# Altium schematic sheet SCH_07_ADC.SchDoc
size A4; SheetNumber: 12; SheetTotal: 12; SPICEModelCacheAFFBQUIG: <root> / <DocumentId>AFFBQUIG</DocumentId> / <CacheFrame Number="0"> / <Model Name="0603_885012106031_10uf" Kind="CKT"> / <Text>******* / .subckt 0603_885012106031_10uF 1 2 / Rser 1 3 0.0105 / Lser 2 4 0.0000000008 / C1 3 4 0.00001 / Rpar 3 4 10000000 / .ends 0603_885012106031_10uF</Text> / </Model> / <Model Name="0603_885012206095_100nf" Kind="CKT"> / <Text>******* / .subckt 0603_885012206095_100nF 1 2 / Rser 1 3 0.0157659152881 / Lser 2 4 3.10171966E-10 / C1 3 4 0.0000001 / Rpar 3 4 5000000000 / .ends 0603_885012206095_100nF</Text> / </Model> / </CacheFrame> / </root>
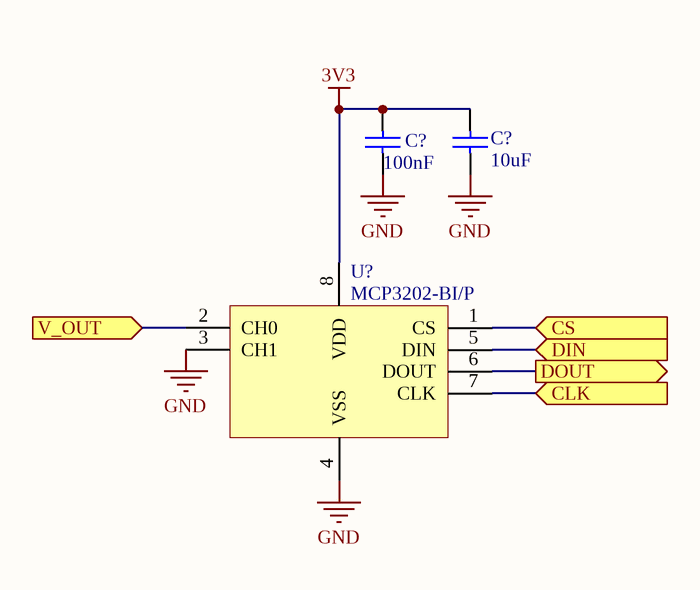
[diagram p0: SCH_07_ADC.SchDoc]

## Parts
(Parts that share a designator on the sheet are numbered #1, #2 ... from top to bottom, then left to right.)
C?#1  100nF  [WCAP-CSGP_0603_L1.6W0.8H0.8_Reflow]
C?#2  10uF  [WCAP-CSGP_0603_L1.6W0.8H0.8_Reflow]
U?  MCP3202-BI/P  [DIP787W46P254L927H533Q8]

## Ports
CLK (in, see Schematic_Top[4B]), CS (in, see Schematic_Top[4B]), DIN (in, see Schematic_Top[4B]), DOUT (out, see Schematic_Top[4B]), V_OUT (in, see Schematic_Top[3B], SCH_06_Filter[4C])

## Nets
3V3: C?#1.2 C?#2.2 U?.8(VDD)
GND: C?#1.1 C?#2.1 U?.3(CH1) U?.4(VSS)
CLK: U?.7(CLK) ; port CLK
CS: U?.1(CS) ; port CS
DIN: U?.5(DIN) ; port DIN
DOUT: U?.6(DOUT) ; port DOUT
V_OUT: U?.2(CH0) ; port V_OUT

## Notes on the sheet
- Title:
- Date:
- Time:
- Drawn by:
- Phung Nhat Minh
- Sheet
- of

## Library data of the parts
C?#1 = 885012206095: WCAP-CSGP Multilayer Ceramic Chip Capacitor, General Purpose, size 0603, X7R, 100nF, 50VDC; Manufacturer: Wurth Elektronik; Case/Size Code: 0603; Capacitance Tolerance: +/-10%; Dissipation Factor: 3%; Insulation Resistance: 5GOhm; Rated Voltage (DC): 50V; Technical Reference: X7R0603104K050DFCT10000; Manufacturer Part Number: 885012206095; Category: Multilayer Ceramic Chip Capacitors; Match Code: WCAP-CSGP; ComponentLink1Description: Website Link; ComponentLink1URL: https://www.we-online.com/redexpert/article/885012206095?ad; ComponentLink2Description: Datasheet Link; ComponentLink2URL: https://www.we-online.com/redexpert/spec/885012206095?ad; Mount: Surface Mount; Operating Temperature Max: 125°C; Operating Temperature Min: -55°C; Packaging: Tape and Reel; Length: 1.6mm; Width: 0.8mm; Height: 0.8mm; Capacitance: 100nF; Ceramic Type: X7R
C?#2 = 885012106031: WCAP-CSGP Multilayer Ceramic Chip Capacitor, General Purpose, size 0603, X5R, 10uF, 25VDC; Manufacturer: Wurth Elektronik; Case/Size Code: 0603; Capacitance Tolerance: +/20%; Dissipation Factor: 20%; Insulation Resistance: 0.01GOhm; Rated Voltage (DC): 25V; Technical Reference: X5R0603106M025DFCT10000; Manufacturer Part Number: 885012106031; Category: Multilayer Ceramic Chip Capacitors; Match Code: WCAP-CSGP; ComponentLink1Description: Website Link; ComponentLink1URL: https://www.we-online.com/redexpert/article/885012106031?ad; ComponentLink2Description: Datasheet Link; ComponentLink2URL: https://www.we-online.com/redexpert/spec/885012106031?ad; Mount: Surface Mount; Operating Temperature Max: 85°C; Operating Temperature Min: -55°C; Packaging: Tape and Reel; Length: 1.6mm; Width: 0.8mm; Height: 0.8mm; Capacitance: 10uF; Ceramic Type: X5R